# Altium schematic sheet AUDIO_CODEC.SchDoc
size A4; SheetNumber: 9; SheetTotal: 15
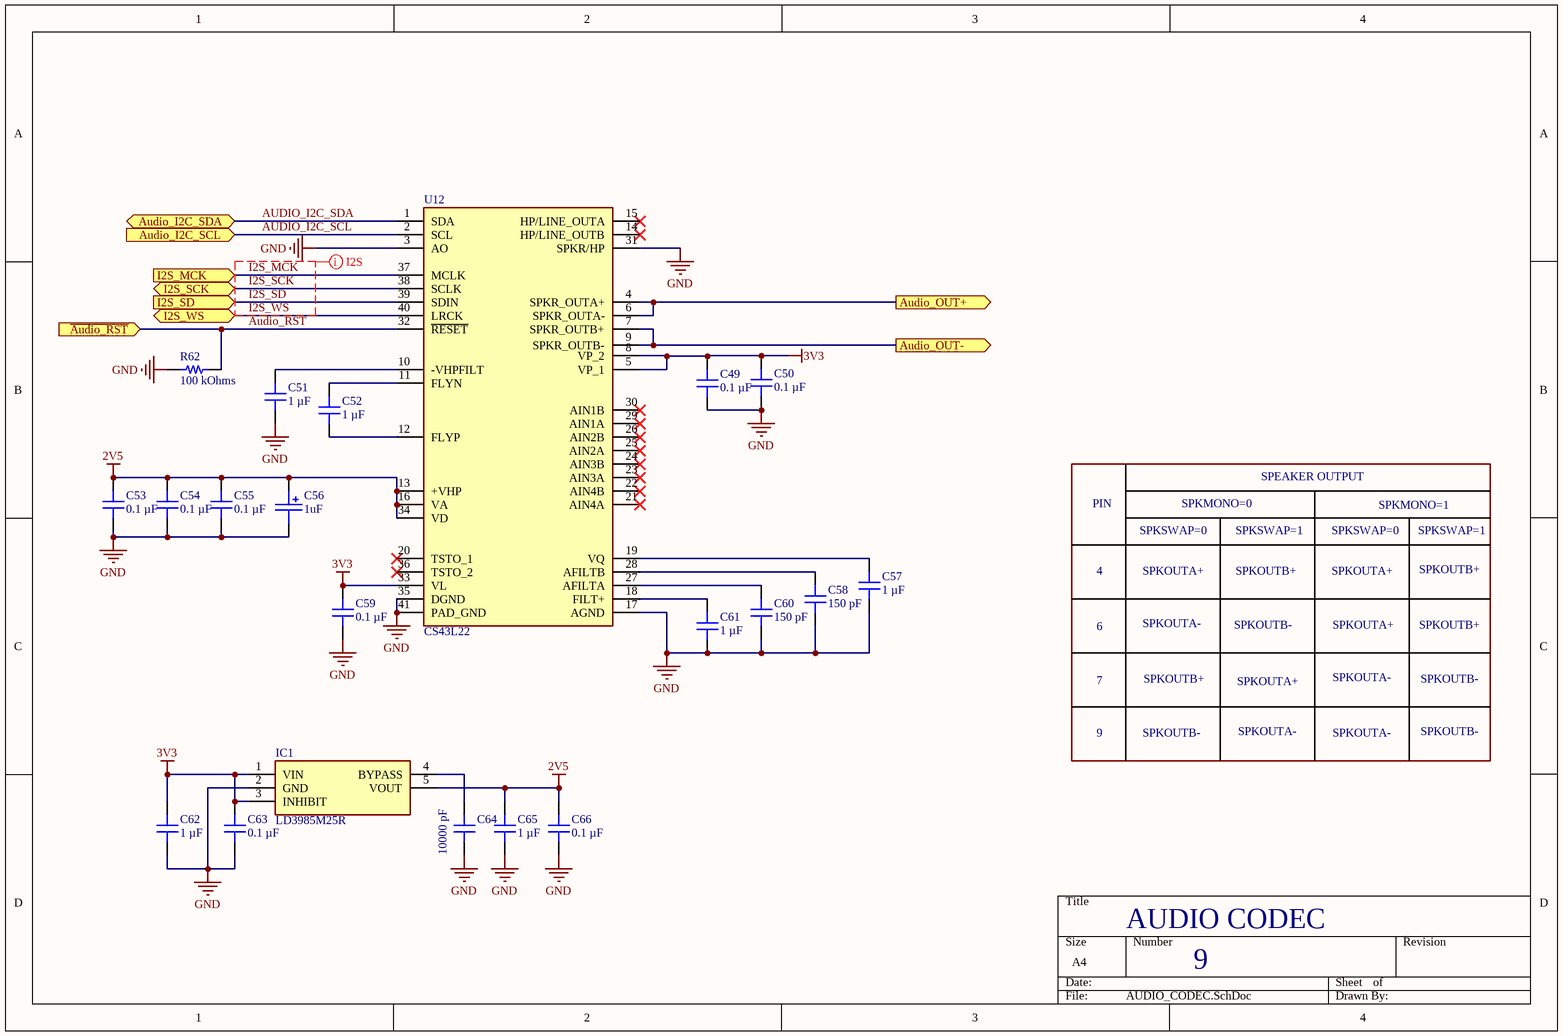
[diagram p0: AUDIO_CODEC.SchDoc]

## Parts
C49  0.1 µF  [CAP 0402_1005]
C50  0.1 µF  [CAP 0402_1005]
C51  1 µF  [CAP 0603_1608]
C52  1 µF  [CAP 0603_1608]
C53  0.1 µF  [CAP 0402_1005]
C54  0.1 µF  [CAP 0402_1005]
C55  0.1 µF  [CAP 0402_1005]
C56  1uF  [TATAJA105K016R]
C57  1 µF  [CAP 0603_1608]
C58  150 pF  [CAP 0603_1608]
C59  0.1 µF  [CAP 0402_1005]
C60  150 pF  [CAP 0603_1608]
C61  1 µF  [CAP 0603_1608]
C62  1 µF  [CAP 0603_1608]
C63  0.1 µF  [CAP 0402_1005]
C64  10000 pF  [CAP 0603_1608]
C65  1 µF  [CAP 0603_1608]
C66  0.1 µF  [CAP 0402_1005]
IC1  LD3985M25R  [SOT95P280X145-5N]
R62  100 kOhms  [RES 0603_1608]
U12  CS43L22  [QFN50P600X600X100-41N-D]

## Ports
Audio_I2C_SCL (in), Audio_I2C_SDA (bidir), Audio_OUT+ (out), Audio_OUT- (out), I2S_MCK (in), I2S_SCK (bidir), I2S_SD (in), I2S_WS (bidir), ~{Audio_RST} (in)

## Nets
2V5: C53.2 C54.2 C55.2 C56.1(+) C65.2 C66.2 IC1.5(VOUT) U12.13(+VHP) U12.16(VA) U12.34(VD)
3V3: C49.2 C50.2 C59.2 C62.2 C63.2 IC1.1(VIN) IC1.3(INHIBIT) U12.5(VP_1) U12.8(VP_2) U12.33(VL)
GND: C49.1 C50.1 C51.1 C53.1 C54.1 C55.1 C56.2(-) C57.1 C58.1 C59.1 C60.1 C61.1 C62.1 C63.1 C64.1 C65.1 C66.1 IC1.2(GND) R62.1 U12.3(AO) U12.17(AGND) U12.31(SPKR/HP) U12.35(DGND) U12.41(PAD_GND)
AUDIO_I2C_SCL: U12.2(SCL) ; port Audio_I2C_SCL
AUDIO_I2C_SDA: U12.1(SDA) ; port Audio_I2C_SDA
Audio_OUT+: U12.4(SPKR_OUTA+) U12.6(SPKR_OUTA-) ; port Audio_OUT+
Audio_OUT-: U12.7(SPKR_OUTB+) U12.9(SPKR_OUTB-) ; port Audio_OUT-
Audio_RST: R62.2 U12.32(~{RESET}) ; port ~{Audio_RST}
I2S_MCK: U12.37(MCLK) ; port I2S_MCK
I2S_SCK: U12.38(SCLK) ; port I2S_SCK
I2S_SD: U12.39(SDIN) ; port I2S_SD
I2S_WS: U12.40(LRCK) ; port I2S_WS
NetC51_2: C51.2 U12.10(-VHPFILT)
NetC52_1: C52.1 U12.12(FLYP)
NetC52_2: C52.2 U12.11(FLYN)
NetC57_2: C57.2 U12.19(VQ)
NetC58_2: C58.2 U12.28(AFILTB)
NetC60_2: C60.2 U12.27(AFILTA)
NetC61_2: C61.2 U12.18(FILT+)
NetC64_2: C64.2 IC1.4(BYPASS)

Not connected (* = marked no-connect by the designer): U12 14(HP/LINE_OUTB)* 15(HP/LINE_OUTA)* 20(TSTO_1)* 21(AIN4A)* 22(AIN4B)* 23(AIN3A)* 24(AIN3B)* 25(AIN2A)* 26(AIN2B)* 29(AIN1A)* 30(AIN1B)* 36(TSTO_2)*

## Layout directives
net class I2S: I2S_MCK, I2S_SCK, I2S_SD, I2S_WS

## Notes on the sheet
- PIN
- SPKMONO=0
- SPEAKER OUTPUT
- SPKMONO=1
- 4
- SPKSWAP=0
- SPKOUTA+
- SPKSWAP=1
- SPKOUTB+
- 6
- SPKOUTA-
- SPKOUTB-
- 7
- 9
- AUDIO CODEC

## Library data of the parts
C49 C50 C53-C55 C59 C63 C66 = CC0402KRX7R7BB104: CAP CER 0.1UF 16V X7R 0402; manufacturer: Yageo; Tolerance: ±10%; Part Number: CC0402KRX7R7BB104; Value: 0.1 µF; Applications: General Purpose; Capacitance: 0.1 µF; componentlink1description: Datasheet; componentlink1url: https://www.yageo.com/upload/media/product/productsearch/datasheet/mlcc/UPY-GPHC_X7R_6.3V-to-50V_18.pdf; componentlink2description: DigiKey Link; componentlink2url: https://www.digikey.com/en/products/detail/yageo/CC0402KRX7R7BB104/2103076; Device Package: 0402 (1005 Metric); lastupdated: 19.06.2022 07:45:35; Lifecycle Status: Active; Minimum Order: 1; Mounting Type: Surface Mount, MLCC; Operating Temperature: -55°C ~ 125°C; Package / Case: 0402 (1005 Metric); packaging: TapeAndReel; partid: 4014; Part Status: Active; price: 0.01; series: CC; Size / Dimension: 0.039" L x 0.020" W (1.00mm x 0.50mm); Supplier 1: DigiKey; Supplier Part Number 1: 311-1338-1-ND; Temperature Coefficient: X7R; Thickness (Max): 0.022" (0.55mm); Voltage - Rated: 16V
C51 C52 C57 C61 C62 C65 = CC0603KRX5R7BB105: CAP CER 1UF 16V X5R 0603; manufacturer: Yageo; Tolerance: ±10%; Part Number: CC0603KRX5R7BB105; Value: 1 µF; Applications: General Purpose; Capacitance: 1 µF; componentlink1description: Datasheet; componentlink1url: https://www.yageo.com/upload/media/product/productsearch/datasheet/mlcc/UPY-GPHC_X5R_4V-to-50V_25.pdf; componentlink2description: DigiKey Link; componentlink2url: https://www.digikey.com/en/products/detail/yageo/CC0603KRX5R7BB105/2833609; Device Package: 0603 (1608 Metric); lastupdated: 19.06.2022 07:49:01; Lifecycle Status: Active; Minimum Order: 1; Mounting Type: Surface Mount, MLCC; Operating Temperature: -55°C ~ 85°C; Package / Case: 0603 (1608 Metric); packaging: TapeAndReel; partid: 12399; Part Status: Active; price: 0.01; series: CC; Size / Dimension: 0.063" L x 0.031" W (1.60mm x 0.80mm); Supplier 1: DigiKey; Supplier Part Number 1: 311-1444-1-ND; Temperature Coefficient: X5R; Thickness (Max): 0.035" (0.90mm); Voltage - Rated: 16V
C56 = TAJA105K016R: Tantalum Capacitors - Solid SMD 16V 1uF 10%
C58 C60 = CC0603JRNPO9BN151: CAP CER 150PF 50V C0G/NPO 0603; manufacturer: Yageo; Temperature Coefficient: C0G, NP0; Tolerance: ±5%; Part Number: CC0603JRNPO9BN151; Value: 150 pF; Applications: General Purpose; Capacitance: 150 pF; componentlink1description: Datasheet; componentlink1url: https://www.yageo.com/upload/media/product/productsearch/datasheet/mlcc/UPY-GP_NP0_16V-to-50V_17.pdf; componentlink2description: DigiKey Link; componentlink2url: https://www.digikey.com/en/products/detail/yageo/CC0603JRNPO9BN151/302805; Device Package: 0603 (1608 Metric); lastupdated: 19.06.2022 07:49:09; Lifecycle Status: Active; Minimum Order: 1; Mounting Type: Surface Mount, MLCC; Operating Temperature: -55°C ~ 125°C; Package / Case: 0603 (1608 Metric); packaging: TapeAndReel; partid: 9527; Part Status: Active; price: 0.01; series: CC; Size / Dimension: 0.063" L x 0.031" W (1.60mm x 0.80mm); Supplier 1: DigiKey; Supplier Part Number 1: 311-1071-1-ND; Thickness (Max): 0.035" (0.90mm); Voltage - Rated: 50V
C64 = CC0603KRX7R9BB103: CAP CER 10000PF 50V X7R 0603; manufacturer: Yageo; Tolerance: ±10%; Part Number: CC0603KRX7R9BB103; Value: 10000 pF; Applications: General Purpose; Capacitance: 10000 pF; componentlink1description: Datasheet; componentlink1url: https://www.yageo.com/upload/media/product/productsearch/datasheet/mlcc/UPY-GPHC_X7R_6.3V-to-50V_18.pdf; componentlink2description: DigiKey Link; componentlink2url: https://www.digikey.com/en/products/detail/yageo/CC0603KRX7R9BB103/302819; Device Package: 0603 (1608 Metric); lastupdated: 19.06.2022 07:48:39; Lifecycle Status: Active; Minimum Order: 1; Mounting Type: Surface Mount, MLCC; Operating Temperature: -55°C ~ 125°C; Package / Case: 0603 (1608 Metric); packaging: TapeAndReel; partid: 17848; Part Status: Active; price: 0.01; series: CC; Size / Dimension: 0.063" L x 0.031" W (1.60mm x 0.80mm); Supplier 1: DigiKey; Supplier Part Number 1: 311-1085-1-ND; Temperature Coefficient: X7R; Thickness (Max): 0.035" (0.90mm); Voltage - Rated: 50V
IC1 = LD3985M25R: Integrated Circuit; Manufacturer_Name: STMicroelectronics; Datasheet Link: http://www.st.com/st-web-ui/static/active/en/resource/technical/document/datasheet/CD00003395.pdf; Height: 1.45mm; Manufacturer_Part_Number: LD3985M25R; Mouser Part Number: 511-LD3985M25R; Mouser Price/Stock: https://www.mouser.co.uk/ProductDetail/STMicroelectronics/LD3985M25R?qs=ZGqKRUKL60IuOBLDZX%252B3yw%3D%3D; Arrow Part Number: LD3985M25R; Arrow Price/Stock: https://www.arrow.com/en/products/ld3985m25r/stmicroelectronics?region=nac
R62 = RMCF0603JT100K: RES 100K OHM 5% 1/10W 0603; Manufacturer: Stackpole Electronics Inc; Power (Watts): 0.1W, 1/10W; Temperature Coefficient: ±200ppm/°C; Part Number: RMCF0603JT100K; Value: 100 kOhms; ComponentLink1Description: Datasheet; ComponentLink1URL: https://www.seielect.com/catalog/sei-rmcf_rmcp.pdf; ComponentLink2Description: DigiKey Link; ComponentLink2URL: https://www.digikey.com/en/products/detail/stackpole-electronics-inc/RMCF0603JT100K/1758100; Composition: Thick Film; Device Package: 0603 (1608 Metric); Features: Automotive AEC-Q200; Height - Seated (Max): 0.022" (0.55mm); LastUpdated: 22.06.2022 13:19:51; Lifecycle Status: Active; Minimum Order: 1; Number of Terminations: 2; Operating Temperature: -55°C ~ 155°C; Package / Case: 0603 (1608 Metric); Packaging: CutTape; PartId: 5863; Part Status: Active; Price: 0.01; Ratings: AEC-Q200; Resistance: 100 kOhms; Series: RMCF; Size / Dimension: 0.061" L x 0.031" W (1.55mm x 0.80mm); Supplier 1: DigiKey; Supplier Part Number 1: RMCF0603JT100KCT-ND; Supplier Device Package: 0603; Tolerance: ±5%
U12 = CS43L22-CNZ: IC DAC/AUDIO 24BIT 96K 40QFN